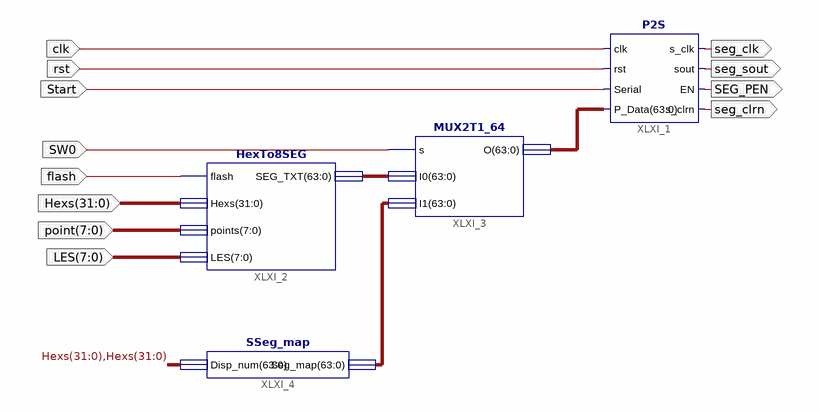
[diagram p0: schematic sheet 1]
// Xilinx ISE schematic Display.sch (kintex7) as structural Verilog: 4 symbols, 12 ports
module Display (
  input  clk,
  input  rst,
  input  Start,
  input  [31:0] Hexs,
  input  [7:0] point,
  input  [7:0] LES,
  input  flash,
  input  SW0,
  output seg_clk,
  output seg_sout,
  output SEG_PEN,
  output seg_clrn
);

  wire [63:0] XLXN_34, XLXN_35, XLXN_39;

  HexTo8SEG XLXI_2 (.flash(flash), .Hexs(Hexs), .points(point), .LES(LES), .SEG_TXT(XLXN_34));
  MUX2T1_64 XLXI_3 (.s(SW0), .I0(XLXN_34), .I1(XLXN_35), .O(XLXN_39));
  SSeg_map XLXI_4 (.Disp_num({Hexs, Hexs}), .Seg_map(XLXN_35));
  P2S XLXI_1 (
    .s_clrn(seg_clrn), .sout(seg_sout), .rst(rst), .EN(SEG_PEN), .Serial(Start), .clk(clk), .s_clk(seg_clk),
    .P_Data(XLXN_39));
endmodule
